# EAGLE design power (EAGLE 6.4)

## Sheet 1 of 3: Power
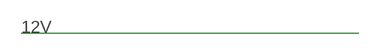
[diagram p0: schematic, sheet 1]

## Sheet 2 of 3: B-t-B
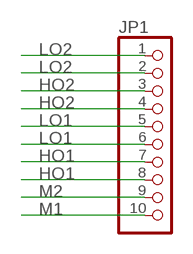
[diagram p1: schematic, sheet 2]

### Parts
JP1  PINHD-1X10_2.54  [1X10]

### Nets
HO1: JP1.7 JP1.8 ; also sheet 3
HO2: JP1.3 JP1.4 ; also sheet 3
LO1: JP1.5 JP1.6 ; also sheet 3
LO2: JP1.1 JP1.2 ; also sheet 3
M1: JP1.10 ; also sheet 3
M2: JP1.9 ; also sheet 3

## Sheet 3 of 3: H-Bridge
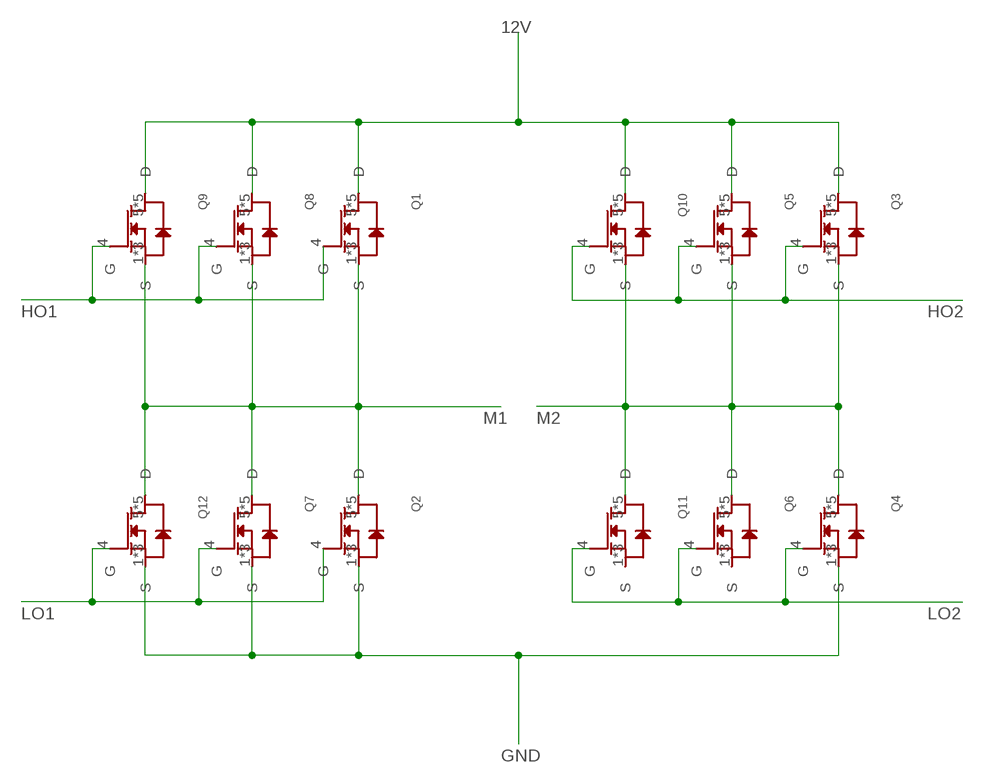
[diagram p2: schematic, sheet 3]

### Parts
Q1  CSD18540Q5B  [Q5B]
Q2  CSD18540Q5B  [Q5B]
Q3  CSD18540Q5B  [Q5B]
Q4  CSD18540Q5B  [Q5B]
Q5  CSD18540Q5B  [Q5B]
Q6  CSD18540Q5B  [Q5B]
Q7  CSD18540Q5B  [Q5B]
Q8  CSD18540Q5B  [Q5B]
Q9  CSD18540Q5B  [Q5B]
Q10  CSD18540Q5B  [Q5B]
Q11  CSD18540Q5B  [Q5B]
Q12  CSD18540Q5B  [Q5B]

### Nets
12V: Q1.5(D) Q1.6(D) Q1.7(D) Q1.8(D) Q1.9(D) Q3.5(D) Q3.6(D) Q3.7(D) Q3.8(D) Q3.9(D) Q5.5(D) Q5.6(D) Q5.7(D) Q5.8(D) Q5.9(D) Q8.5(D) Q8.6(D) Q8.7(D) Q8.8(D) Q8.9(D) Q9.5(D) Q9.6(D) Q9.7(D) Q9.8(D) Q9.9(D) Q10.5(D) Q10.6(D) Q10.7(D) Q10.8(D) Q10.9(D) ; also sheet 1
GND: Q2.1(S) Q2.2(S) Q2.3(S) Q4.1(S) Q4.2(S) Q4.3(S) Q7.1(S) Q7.2(S) Q7.3(S) Q12.1(S) Q12.2(S) Q12.3(S)
HO1: Q1.4(G) Q8.4(G) Q9.4(G) ; also sheet 2
HO2: Q3.4(G) Q5.4(G) Q10.4(G) ; also sheet 2
LO1: Q2.4(G) Q7.4(G) Q12.4(G) ; also sheet 2
LO2: Q4.4(G) Q6.4(G) Q11.4(G) ; also sheet 2
M1: Q1.1(S) Q1.2(S) Q1.3(S) Q2.5(D) Q2.6(D) Q2.7(D) Q2.8(D) Q2.9(D) Q7.5(D) Q7.6(D) Q7.7(D) Q7.8(D) Q7.9(D) Q8.1(S) Q8.2(S) Q8.3(S) Q9.1(S) Q9.2(S) Q9.3(S) Q12.5(D) Q12.6(D) Q12.7(D) Q12.8(D) Q12.9(D) ; also sheet 2
M2: Q3.1(S) Q3.2(S) Q3.3(S) Q4.5(D) Q4.6(D) Q4.7(D) Q4.8(D) Q4.9(D) Q5.1(S) Q5.2(S) Q5.3(S) Q6.5(D) Q6.6(D) Q6.7(D) Q6.8(D) Q6.9(D) Q10.1(S) Q10.2(S) Q10.3(S) Q11.5(D) Q11.6(D) Q11.7(D) Q11.8(D) Q11.9(D) ; also sheet 2
Unconnected: Q6.1(S) Q6.2(S) Q6.3(S) Q11.1(S) Q11.2(S) Q11.3(S)

## Library data of the parts
JP1 = pinhead-1:PINHD-1X10: PIN HEADER
Q1-Q12 = common:CSD18540Q5B: N-Channel High-Power MosFET; I_MAX: 221A; PD: 195W; PULSED_DRAIN_CURRENT: 400A; VGS: +/- 20V; V_MAX: 60V

## Board
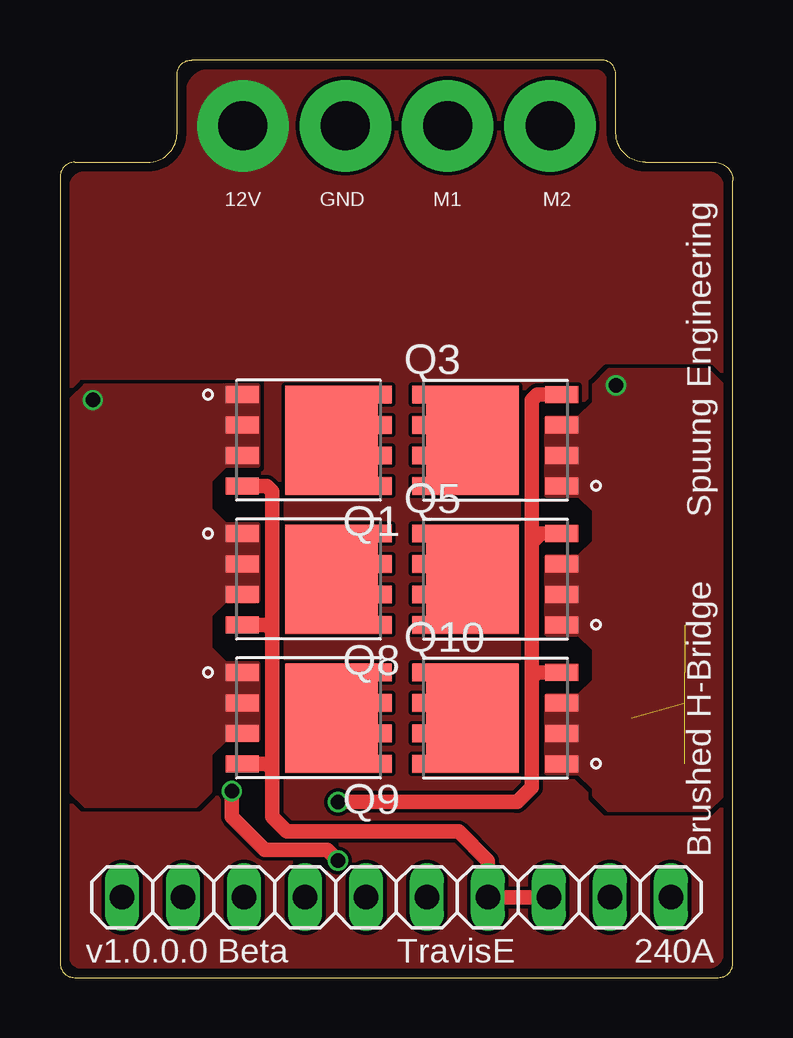
[diagram p3: board, top side]
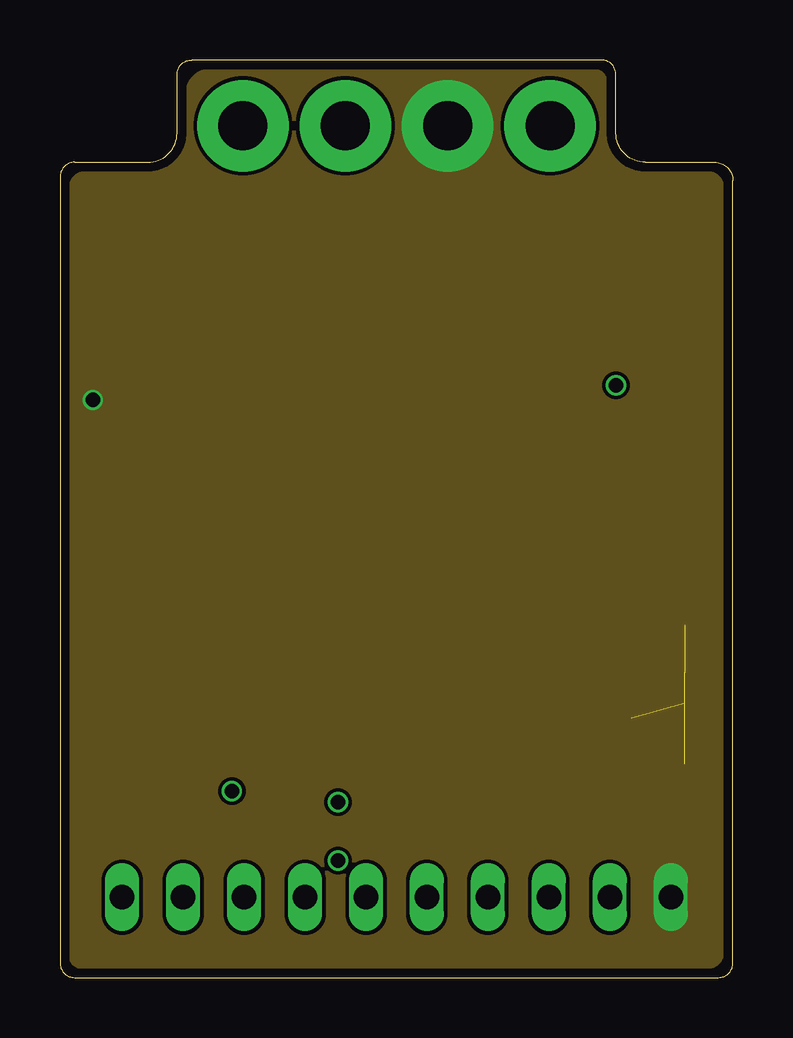
[diagram p4: board, inner layer Route2]
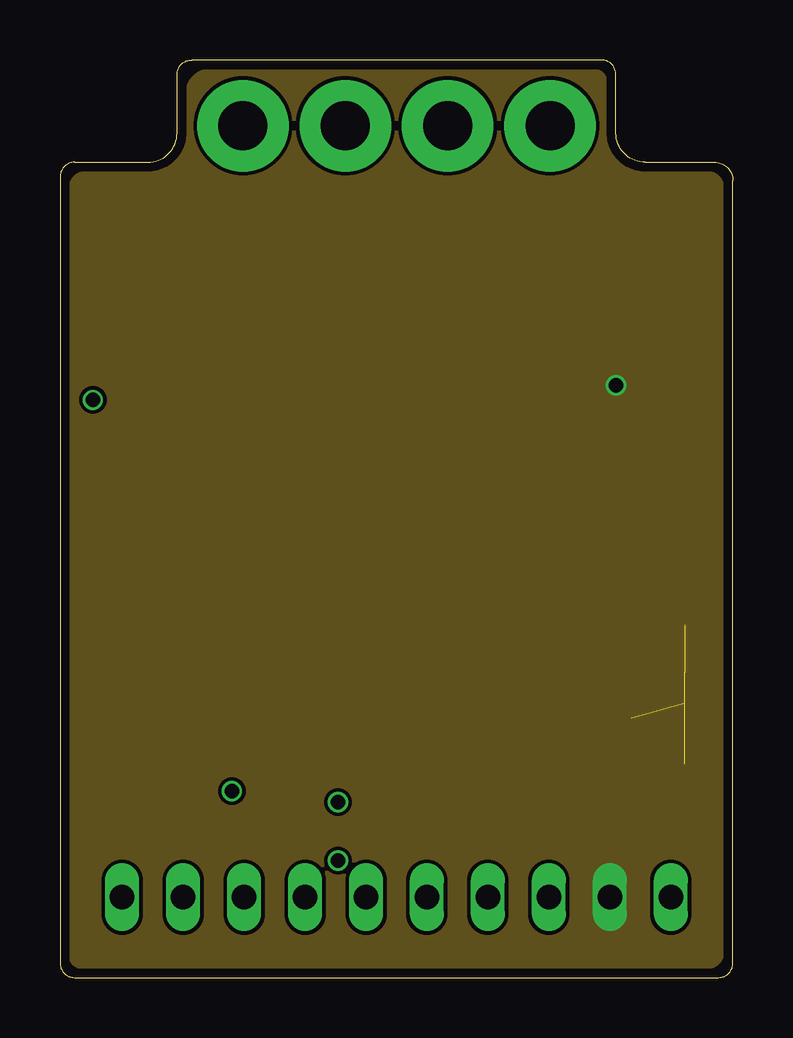
[diagram p5: board, inner layer Route3]
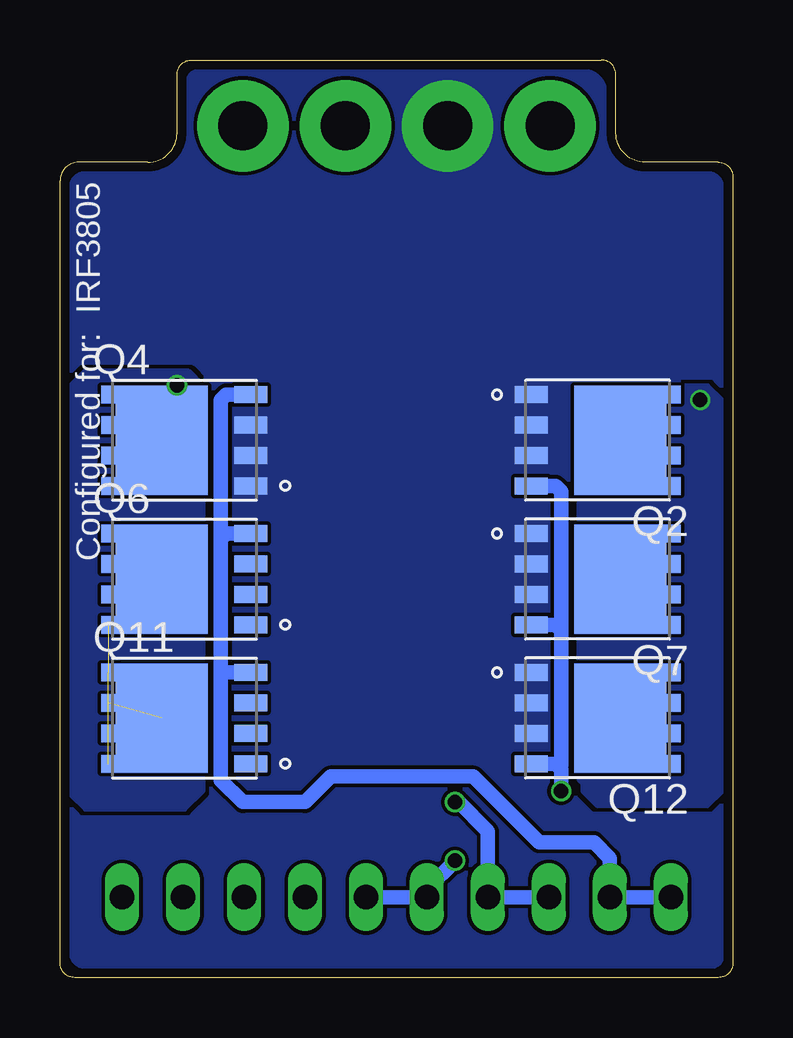
[diagram p6: board, bottom side, seen from below]

Size 28.04 x 38.25 mm. Coordinates in mm from the lower left corner, seen from the top.
Outline: 0.61,0 27.43,0 arc90 28.04,0.61 28.04,33.22 arc90 27.28,33.99 24.38,33.99 arc-90 23.17,35.2 23.17,37.64 arc90 22.56,38.25 5.49,38.25 arc90 4.88,37.64 4.88,35.2 arc-90 3.66,33.99 0.61,33.99 arc90 0,33.38 0,0.61 arc90 0.61,0
Copper layers (1*2*3*16): Top 0.035559375mm / dielectric 0.17018125mm / Route2 0.01778125mm / dielectric 47mil / Route3 0.01778125mm / dielectric 0.17018125mm / Bottom 0.035559375mm
Design rules "LaenPCBOrder *": minimum track width 5mil, minimum drill 10mil, track to track 6mil, track to pad 6mil, pad to pad 6mil, via to via 6mil, smd to smd 6mil, copper to edge 15mil, drill to drill 6mil, minimum pad ring 4mil, minimum via ring 4mil, stop-mask expansion 4mil, vias tented up to drill 13mil, thermal gap 10mil

### Footprints (pad centres in the part's own frame; a part is rotated, then mirrored left to right if it is on the bottom)
1X10 = drill 1.016 long: 1 -11.43,0; 2 -8.89,0; 3 -6.35,0; 4 -3.81,0; 5 -1.27,0; 6 1.27,0; 7 3.81,0; 8 6.35,0; 9 8.89,0; 10 11.43,0
Q5B = smd 1.372 x 0.71: 1 2.77,-1.905; 2 2.77,-0.635; 3 2.77,0.635; 4 2.77,1.905 | smd 0.59 x 0.71: 5 -3.161,1.905; 6 -3.161,0.635; 7 -3.161,-0.635; 8 -3.161,-1.905 | smd 3.85 x 4.52: 9 -0.941,0

### Placement (x,y rotation side)
JP1  14.02,3.35 0 top
Q1  10.36,22.4 180 top
Q2  5.64,22.4 180 bottom
Q3  18.14,22.4 0 top
Q4  22.86,22.4 0 bottom
Q5  18.14,16.61 0 top
Q6  22.86,16.61 0 bottom
Q7  5.64,16.61 180 bottom
Q8  10.36,16.61 180 top
Q9  10.36,10.82 180 top
Q10  18.14,10.82 0 top
Q11  22.86,10.82 0 bottom
Q12  5.64,10.82 180 bottom

### Tracks (layer width: path | path; a pad name or v marks a point on that pad's centre or on a via)
12V  (via drill 2.03 pad 3.81)
  other vias: 7.62,35.51
  pour Top (rank 6, no thermals): 22.25,37.8 6.25,37.8 arc90 5.33,36.88 5.33,35.36 arc-90 3.51,33.53 1.07,33.53 arc90 0.46,32.92 0.46,0.91 arc90 0.91,0.46 26.97,0.46 arc90 27.58,1.07 27.58,32.92 arc90 26.97,33.53 24.38,33.53 arc-90 22.71,35.2 22.71,37.34 arc90
GND  (via drill 2.03 pad 3.81)
  other vias: 11.89,35.51
  pour Bottom (rank 6, no thermals): 22.25,37.8 6.25,37.8 arc90 5.33,36.88 5.33,35.36 arc-90 3.51,33.53 1.07,33.53 arc90 0.46,32.92 0.46,0.91 arc90 0.91,0.46 26.97,0.46 arc90 27.58,1.07 27.58,32.92 arc90 26.97,33.53 24.38,33.53 arc-90 22.71,35.2 22.71,37.34 arc90
HO1
  Top 0.61: Q9.4 8.61,8.92 8.84,8.69 | 8.84,8.69 8.84,6.71 9.45,6.1 16.61,6.1 17.83,4.88 JP1.7 JP1.8 | Q8.4 8.61,14.71 8.84,14.48 | 8.84,14.48 8.84,14.33 8.84,8.69 | Q1.4 8.61,20.5 8.84,20.27 8.84,14.48
HO2  (via drill 0.6)
  Top 0.61: Q3.4 19.89,24.31 19.66,24.08 19.66,18.14 | 19.66,18.14 19.66,12.5 | 19.66,12.5 19.66,7.92 19.05,7.32 v11.58,7.32 | Q10.4 19.89,12.73 19.66,12.5 | Q5.4 20.04,18.52 19.66,18.14
  Bottom 0.61: v11.58,7.32 11.43,7.32 10.21,6.1 JP1.4 JP1.3
LO1  (via drill 0.6)
  Top 0.61: v11.58,4.88 11.12,5.33 8.53,5.33 7.16,6.71 v7.16,7.77
  Bottom 0.61: v11.58,4.88 12.75,3.71 JP1.5 JP1.6 | v7.16,7.77 7.16,8.69 7.24,8.76 | Q12.4 7.39,8.92 7.24,8.76 | Q7.4 7.39,14.71 7.16,14.48 | 7.16,14.48 7.16,8.84 7.24,8.76 | Q2.4 7.39,20.5 7.16,20.27 7.16,14.48
LO2
  Bottom 0.61: JP1.1 JP1.2 5.13,4.98 5.79,5.64 8.08,5.64 10.82,8.38 16.76,8.38 17.83,7.32 20.42,7.32 21.34,8.23 21.34,12.65 | Q11.4 21.26,12.73 21.34,12.65 | Q6.4 21.11,18.52 21.34,18.29 | 21.34,18.29 21.34,18.14 21.34,12.65 | Q4.4 21.11,24.31 21.34,24.08 21.34,18.29
M1  (via drill 0.6, 2.03 pad 3.81)
  other vias: 16.15,35.51 1.37,24.08
  pour Route2 (rank 6, no thermals): 22.25,37.8 6.25,37.8 arc90 5.33,36.88 5.33,35.36 arc-90 3.51,33.53 1.07,33.53 arc90 0.46,32.92 0.46,0.91 arc90 0.91,0.46 26.97,0.46 arc90 27.58,1.07 27.58,32.92 arc90 26.97,33.53 24.38,33.53 arc-90 22.71,35.2 22.71,37.34 arc90
  pour Top (no thermals): 8.23,9.91 6.86,9.91 6.25,9.3 6.25,7.77 5.64,7.16 1.07,7.16 0.46,7.77 0.46,24.08 1.07,24.69 8.23,24.69 8.23,21.34 6.86,21.34 6.25,20.73 6.25,19.51 6.86,18.9 8.23,18.9 8.23,15.7 6.86,15.7 6.25,15.09 6.25,13.72 6.86,13.11 8.23,13.11
  pour Bottom (no thermals): 6.4,24.69 1.07,24.69 0.46,24.08 0.46,7.77 1.07,7.16 5.64,7.16 6.25,7.77 6.25,8.08 6.4,8.23
M2  (via drill 0.6)  (5 unrouted)
  other vias: 23.16,24.69
  pour Route3 (rank 6, no thermals): 22.25,37.8 6.25,37.8 arc90 5.33,36.88 5.33,35.36 arc-90 3.51,33.53 1.07,33.53 arc90 0.46,32.92 0.46,0.91 arc90 0.91,0.46 26.97,0.46 arc90 27.58,1.07 27.58,32.92 arc90 26.97,33.53 24.38,33.53 arc-90 22.71,35.2 22.71,37.34 arc90
  pour Top (no thermals): 20.27,23.32 20.27,20.12 21.64,20.12 22.25,19.51 22.25,18.14 21.64,17.53 20.27,17.53 20.27,14.33 21.64,14.33 22.25,13.72 22.25,12.34 21.64,11.73 20.27,11.73 20.27,8.53 21.64,8.53 22.25,7.92 22.25,7.62 22.86,7.01 26.97,7.01 27.58,7.62 27.58,24.69 26.97,25.3 22.86,25.3 22.25,24.69 22.25,23.93 21.64,23.32
  pour Bottom (no thermals): 22.1,24.69 22.1,7.77 22.86,7.01 26.97,7.01 27.58,7.62 27.58,24.69 26.97,25.3 22.71,25.3
MOTOR_OUT_2  (via drill 2.03 pad 3.81)
  other vias: 20.42,35.51

### Text on the board
tPlace: 12V | GND | M1 | M2 | Spuung Engineering | Brushed H-Bridge | v1.0.0.0 Beta | TravisE | 240A
bPlace: Configured for: IRF3805
Document: Layer Info | TOP: GND | RT2 : GND | RT3: +12V | BTM: GND